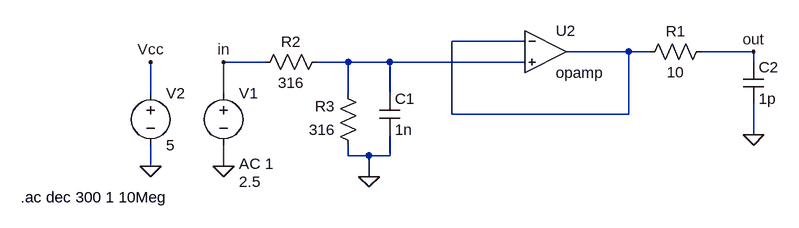
[diagram p0: schematic OPV_pre-amplifier.asc]
OPV_pre-amplifier.asc, the LTspice schematic file:
Version 4
SHEET 1 880 680
WIRE 208 32 96 32
WIRE 368 48 272 48
WIRE 400 48 368 48
WIRE 560 48 480 48
WIRE -192 64 -256 64
WIRE -64 64 -112 64
WIRE 0 64 -64 64
WIRE 208 64 0 64
WIRE 560 64 560 48
WIRE -368 112 -368 64
WIRE -256 112 -256 64
WIRE -64 112 -64 64
WIRE 0 112 0 64
WIRE 96 144 96 32
WIRE 368 144 368 48
WIRE 368 144 96 144
WIRE 560 176 560 128
WIRE -64 208 -64 192
WIRE -32 208 -64 208
WIRE 0 208 0 176
WIRE 0 208 -32 208
WIRE -368 224 -368 192
WIRE -256 224 -256 192
WIRE -32 240 -32 208
FLAG -32 240 0
FLAG -368 224 0
FLAG -368 64 Vcc
FLAG 560 176 0
FLAG 560 48 out
FLAG -256 64 in
FLAG -256 224 0
SYMBOL res 496 32 R90
WINDOW 0 0 56 VBottom 2
WINDOW 3 32 56 VTop 2
SYMATTR InstName R1
SYMATTR Value 10
SYMBOL res -96 48 R90
WINDOW 0 0 56 VBottom 2
WINDOW 3 32 56 VTop 2
SYMATTR InstName R2
SYMATTR Value 316
SYMBOL res -48 208 R180
WINDOW 0 36 76 Left 2
WINDOW 3 36 40 Left 2
SYMATTR InstName R3
SYMATTR Value 316
SYMBOL cap -16 112 R0
SYMATTR InstName C1
SYMATTR Value 1n
SYMBOL cap 544 64 R0
SYMATTR InstName C2
SYMATTR Value 1p
SYMBOL voltage -256 96 R0
WINDOW 3 24 152 Left 2
WINDOW 123 24 124 Left 2
WINDOW 39 0 0 Left 0
SYMATTR Value 2.5
SYMATTR Value2 AC 1
SYMATTR InstName V1
SYMBOL voltage -368 96 R0
WINDOW 123 0 0 Left 0
WINDOW 39 0 0 Left 0
SYMATTR InstName V2
SYMATTR Value 5
SYMBOL Opamps\\opamp 240 -16 R0
SYMATTR InstName U2
TEXT -568 272 Left 2 !.ac dec 300 1 10Meg

The netlist it stands for:
* OPV_pre-amplifier.asc
R1 out N001 10
R2 N002 in 316
R3 0 N002 316
C1 N002 0 1n
C2 out 0 1p
V1 in 0 2.5 AC 1
V2 Vcc 0 5
XU2 N001 N002 N001 opamp Aol=100K GBW=10Meg  ; pins invin noninvin out
.ac dec 300 1 10Meg
.backanno
.end